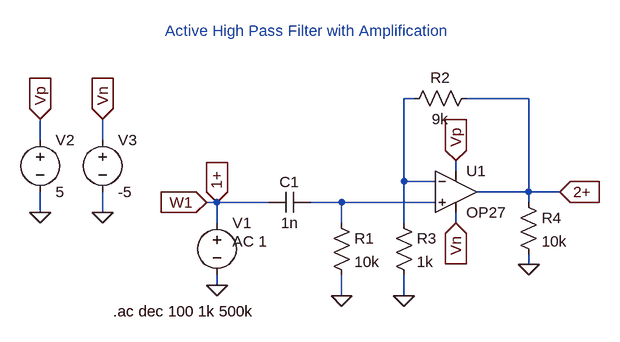
[diagram p0: schematic ahpf_gain.asc]
ahpf_gain.asc, the LTspice schematic file:
Version 4
SHEET 1 880 680
WIRE 176 -576 160 -576
WIRE 352 -576 256 -576
WIRE -400 -512 -400 -544
WIRE -304 -512 -304 -544
WIRE 240 -464 240 -480
WIRE 160 -448 160 -576
WIRE 208 -448 160 -448
WIRE 352 -432 352 -576
WIRE 352 -432 272 -432
WIRE 400 -432 352 -432
WIRE -128 -416 -144 -416
WIRE -48 -416 -128 -416
WIRE 64 -416 16 -416
WIRE 208 -416 64 -416
WIRE 352 -416 352 -432
WIRE -400 -400 -400 -432
WIRE -304 -400 -304 -432
WIRE -128 -384 -128 -416
WIRE 64 -384 64 -416
WIRE 160 -384 160 -448
WIRE 240 -384 240 -400
WIRE 352 -320 352 -336
WIRE -128 -288 -128 -304
WIRE 64 -272 64 -304
WIRE 160 -272 160 -304
FLAG 64 -272 0
FLAG 160 -272 0
FLAG -128 -288 0
FLAG -400 -400 0
FLAG -304 -400 0
FLAG -400 -544 Vp
IOPIN -400 -544 In
FLAG -304 -544 Vn
IOPIN -304 -544 In
FLAG 240 -480 Vp
IOPIN 240 -480 In
FLAG 240 -384 Vn
IOPIN 240 -384 In
FLAG 352 -320 0
FLAG 400 -432 2+
IOPIN 400 -432 In
FLAG -144 -416 W1
IOPIN -144 -416 In
FLAG -128 -416 1+
IOPIN -128 -416 In
SYMBOL Opamps\\OP27 240 -496 R0
SYMATTR InstName U1
SYMBOL cap 16 -432 R90
WINDOW 0 0 32 VBottom 2
WINDOW 3 32 32 VTop 2
SYMATTR InstName C1
SYMATTR Value 1n
SYMBOL res 48 -400 R0
SYMATTR InstName R1
SYMATTR Value 10k
SYMBOL res 272 -592 R90
WINDOW 0 0 56 VBottom 2
WINDOW 3 32 56 VTop 2
SYMATTR InstName R2
SYMATTR Value 9k
SYMBOL res 144 -400 R0
SYMATTR InstName R3
SYMATTR Value 1k
SYMBOL voltage -128 -400 R0
WINDOW 123 24 44 Left 2
WINDOW 39 0 0 Left 0
SYMATTR Value2 AC 1
SYMATTR InstName V1
SYMATTR Value ""
SYMBOL voltage -400 -528 R0
WINDOW 123 0 0 Left 0
WINDOW 39 0 0 Left 0
SYMATTR InstName V2
SYMATTR Value 5
SYMBOL voltage -304 -528 R0
WINDOW 123 0 0 Left 0
WINDOW 39 0 0 Left 0
SYMATTR InstName V3
SYMATTR Value -5
SYMBOL res 336 -432 R0
SYMATTR InstName R4
SYMATTR Value 10k
TEXT -288 -248 Left 2 !.ac dec 100 1k 500k
TEXT -208 -680 Left 2 ;Active High Pass Filter with Amplification

The netlist it stands for:
* ahpf_gain.asc
XU1 N002 N001 Vp Vn 2+ OP27  ; pins In+ In- V+ V- OUT
C1 N002 1+ 1n
R1 N002 0 10k
R2 2+ N001 9k
R3 N001 0 1k
V1 1+ 0 AC 1
V2 Vp 0 5
V3 Vn 0 -5
R4 2+ 0 10k
.ac dec 100 1k 500k
* Active High Pass Filter with Amplification
.lib ADI.lib
.backanno
.end